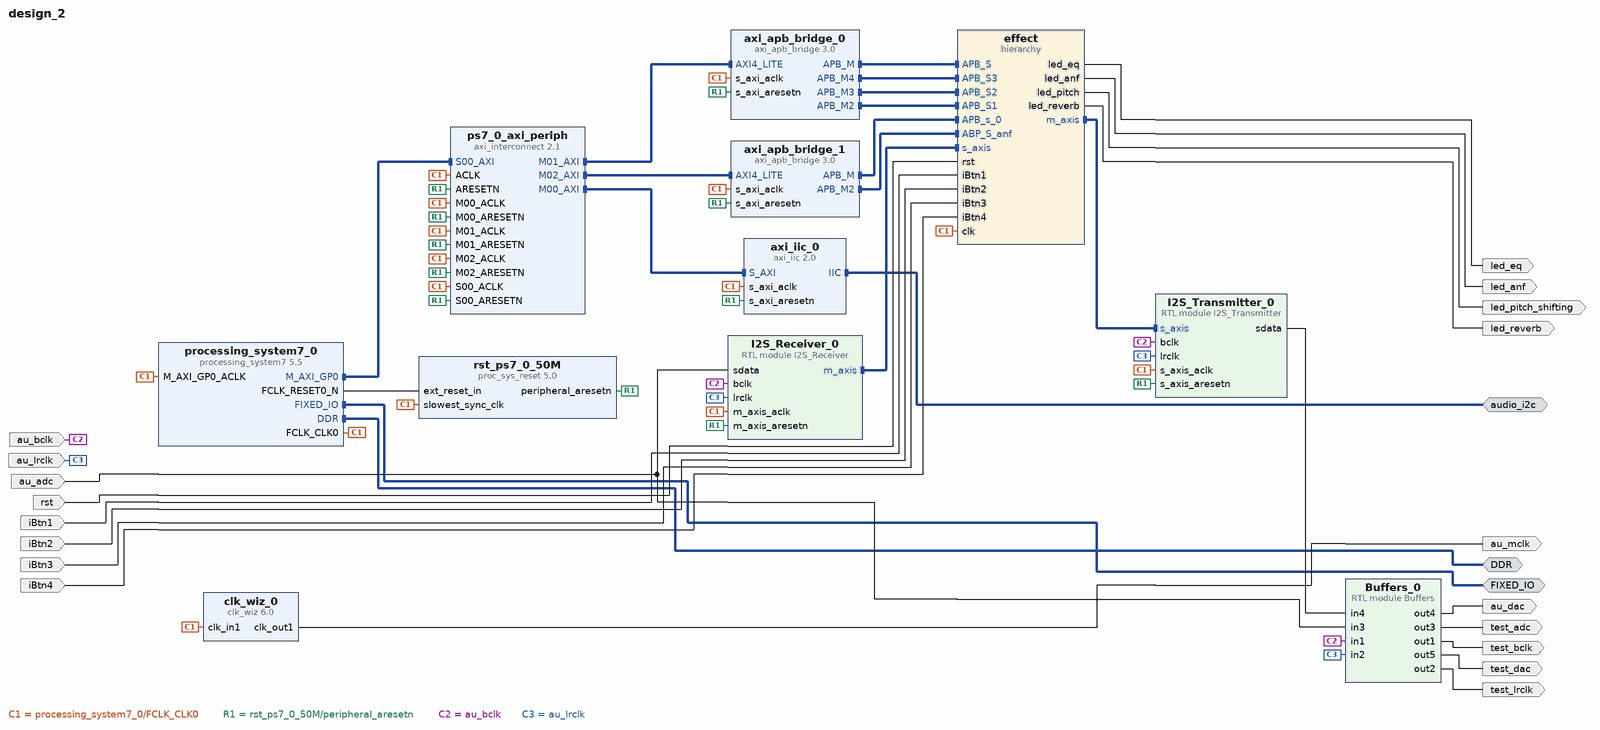
[diagram p0: block diagram of the top level]
# Vivado block design design_2, xc7z020clg400-1, Vivado 2020.1
create_bd_design design_2

create_bd_intf_port -mode Master -vlnv xilinx.com:interface:iic_rtl:1.0 audio_i2c
create_bd_intf_port -mode Master -vlnv xilinx.com:interface:ddrx_rtl:1.0 DDR
create_bd_intf_port -mode Master -vlnv xilinx.com:display_processing_system7:fixedio_rtl:1.0 FIXED_IO
create_bd_port -dir I au_bclk
create_bd_port -dir I au_lrclk
create_bd_port -dir I au_adc
create_bd_port -dir O test_bclk
create_bd_port -dir O test_lrclk
create_bd_port -dir O test_adc
create_bd_port -dir O au_dac
create_bd_port -dir O test_dac
create_bd_port -dir O led_eq
create_bd_port -dir I -type rst rst
create_bd_port -dir I iBtn1
create_bd_port -dir O led_reverb
create_bd_port -dir I iBtn2
create_bd_port -dir O led_pitch_shifting
create_bd_port -dir I iBtn3
create_bd_port -dir O led_anf
create_bd_port -dir I iBtn4
create_bd_port -dir O -type clk au_mclk
set_property -dict {CONFIG.FREQ_HZ 12286002} [get_bd_ports au_mclk]

create_bd_cell -type ip -vlnv xilinx.com:ip:processing_system7:5.5 processing_system7_0
set_property -dict [list \
  CONFIG.PCW_APU_PERIPHERAL_FREQMHZ 650 \
  CONFIG.PCW_CRYSTAL_PERIPHERAL_FREQMHZ 50 \
  CONFIG.PCW_ENET0_ENET0_IO {MIO 16 .. 27} \
  CONFIG.PCW_ENET0_GRP_MDIO_ENABLE 1 \
  CONFIG.PCW_ENET0_GRP_MDIO_IO {MIO 52 .. 53} \
  CONFIG.PCW_ENET0_PERIPHERAL_ENABLE 1 \
  CONFIG.PCW_ENET0_RESET_ENABLE 1 \
  CONFIG.PCW_ENET0_RESET_IO {MIO 9} \
  CONFIG.PCW_ENET_RESET_ENABLE 1 \
  CONFIG.PCW_ENET_RESET_SELECT {Share reset pin} \
  CONFIG.PCW_FPGA0_PERIPHERAL_FREQMHZ 50 \
  CONFIG.PCW_FPGA1_PERIPHERAL_FREQMHZ 10 \
  CONFIG.PCW_GPIO_MIO_GPIO_ENABLE 1 \
  CONFIG.PCW_GPIO_MIO_GPIO_IO MIO \
  CONFIG.PCW_I2C_RESET_ENABLE 1 \
  CONFIG.PCW_M_AXI_GP0_FREQMHZ 10 \
  CONFIG.PCW_PERIPHERAL_BOARD_PRESET part0 \
  CONFIG.PCW_PRESET_BANK1_VOLTAGE {LVCMOS 1.8V} \
  CONFIG.PCW_QSPI_GRP_FBCLK_ENABLE 1 \
  CONFIG.PCW_QSPI_GRP_FBCLK_IO {MIO 8} \
  CONFIG.PCW_QSPI_GRP_SINGLE_SS_ENABLE 1 \
  CONFIG.PCW_QSPI_GRP_SINGLE_SS_IO {MIO 1 .. 6} \
  CONFIG.PCW_QSPI_PERIPHERAL_ENABLE 1 \
  CONFIG.PCW_QSPI_QSPI_IO {MIO 1 .. 6} \
  CONFIG.PCW_SD0_GRP_CD_ENABLE 1 \
  CONFIG.PCW_SD0_GRP_CD_IO {MIO 47} \
  CONFIG.PCW_SD0_GRP_WP_ENABLE 0 \
  CONFIG.PCW_SD0_PERIPHERAL_ENABLE 1 \
  CONFIG.PCW_SD0_SD0_IO {MIO 40 .. 45} \
  CONFIG.PCW_SDIO_PERIPHERAL_FREQMHZ 50 \
  CONFIG.PCW_SINGLE_QSPI_DATA_MODE x4 \
  CONFIG.PCW_UART0_PERIPHERAL_ENABLE 1 \
  CONFIG.PCW_UART0_UART0_IO {MIO 14 .. 15} \
  CONFIG.PCW_UART1_PERIPHERAL_ENABLE 0 \
  CONFIG.PCW_UART_PERIPHERAL_FREQMHZ 100 \
  CONFIG.PCW_UIPARAM_DDR_BUS_WIDTH {16 Bit} \
  CONFIG.PCW_UIPARAM_DDR_FREQ_MHZ 525 \
  CONFIG.PCW_UIPARAM_DDR_PARTNO {MT41J256M16 RE-125} \
  CONFIG.PCW_USB0_PERIPHERAL_ENABLE 1 \
  CONFIG.PCW_USB0_RESET_ENABLE 1 \
  CONFIG.PCW_USB0_RESET_IO {MIO 46} \
  CONFIG.PCW_USB0_USB0_IO {MIO 28 .. 39} \
  CONFIG.PCW_USB_RESET_ENABLE 1 \
  CONFIG.PCW_USB_RESET_SELECT {Share reset pin} \
] [get_bd_cells processing_system7_0]
# 486 more settings of processing_system7_0 are not shown: defaults, MIO pin electricals, DDR timing, and values the tool derives
create_bd_cell -type ip -vlnv xilinx.com:ip:axi_iic:2.0 axi_iic_0
set_property -dict {CONFIG.IIC_BOARD_INTERFACE audio_i2c CONFIG.USE_BOARD_FLOW true} [get_bd_cells axi_iic_0]
create_bd_cell -type ip -vlnv xilinx.com:ip:axi_interconnect:2.1 ps7_0_axi_periph
set_property -dict {CONFIG.NUM_MI 3 CONFIG.NUM_SI 1} [get_bd_cells ps7_0_axi_periph]
create_bd_cell -type ip -vlnv xilinx.com:ip:proc_sys_reset:5.0 rst_ps7_0_50M
create_bd_cell -type ip -vlnv xilinx.com:ip:axi_apb_bridge:3.0 axi_apb_bridge_0
set_property -dict {CONFIG.C_APB_NUM_SLAVES 4} [get_bd_cells axi_apb_bridge_0]
create_bd_cell -type hier effect
create_bd_cell -type ip -vlnv xilinx.com:ip:axi_apb_bridge:3.0 axi_apb_bridge_1
set_property -dict {CONFIG.C_APB_NUM_SLAVES 2} [get_bd_cells axi_apb_bridge_1]
create_bd_cell -type module -reference I2S_Receiver I2S_Receiver_0
set_property -dict {CONFIG.DATA_WIDTH 24} [get_bd_cells I2S_Receiver_0]
create_bd_cell -type module -reference I2S_Transmitter I2S_Transmitter_0
set_property -dict {CONFIG.DATA_WIDTH 24} [get_bd_cells I2S_Transmitter_0]
create_bd_cell -type module -reference Buffers Buffers_0
create_bd_cell -type ip -vlnv xilinx.com:ip:clk_wiz:6.0 clk_wiz_0
set_property -dict [list \
  CONFIG.CLKOUT1_JITTER 373.299 \
  CONFIG.CLKOUT1_PHASE_ERROR 409.976 \
  CONFIG.CLKOUT1_REQUESTED_OUT_FREQ 12.286 \
  CONFIG.MMCM_CLKFBOUT_MULT_F 61.000 \
  CONFIG.MMCM_CLKOUT0_DIVIDE_F 82.750 \
  CONFIG.MMCM_DIVCLK_DIVIDE 3 \
  CONFIG.USE_LOCKED false \
  CONFIG.USE_RESET false \
] [get_bd_cells clk_wiz_0]

# ---- hierarchy /effect ----
current_bd_instance /effect
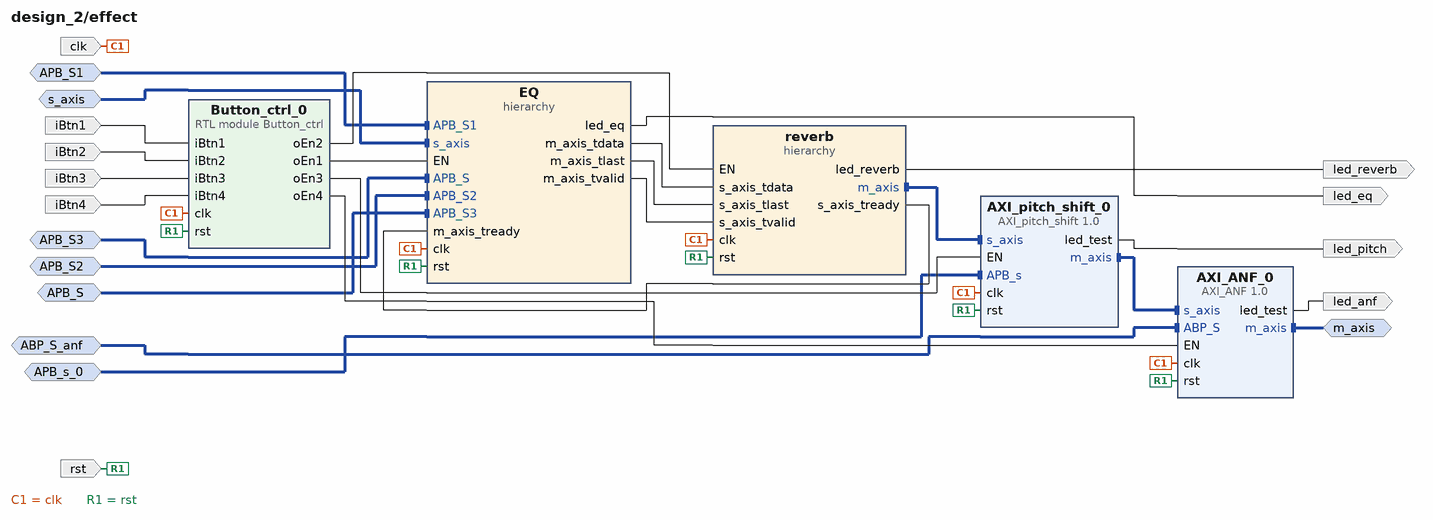
[diagram p1: block diagram inside /effect]
create_bd_intf_pin -mode Slave -vlnv xilinx.com:interface:axis_rtl:1.0 s_axis
create_bd_intf_pin -mode Slave -vlnv xilinx.com:interface:apb_rtl:1.0 APB_S
create_bd_intf_pin -mode Slave -vlnv xilinx.com:interface:apb_rtl:1.0 APB_S1
create_bd_intf_pin -mode Slave -vlnv xilinx.com:interface:apb_rtl:1.0 APB_S2
create_bd_intf_pin -mode Master -vlnv xilinx.com:interface:axis_rtl:1.0 m_axis
create_bd_intf_pin -mode Slave -vlnv xilinx.com:interface:apb_rtl:1.0 APB_S3
create_bd_intf_pin -mode Slave -vlnv xilinx.com:interface:apb_rtl:1.0 APB_s_0
create_bd_intf_pin -mode Slave -vlnv xilinx.com:interface:apb_rtl:1.0 ABP_S_anf
create_bd_pin -dir I -type clk clk
create_bd_pin -dir I -type rst rst
create_bd_pin -dir I iBtn1
create_bd_pin -dir O led_eq
create_bd_pin -dir O led_reverb
create_bd_pin -dir I iBtn2
create_bd_pin -dir O led_pitch
create_bd_pin -dir I iBtn3
create_bd_pin -dir O led_anf
create_bd_pin -dir I iBtn4

create_bd_cell -type hier reverb
create_bd_cell -type ip -vlnv xilinx.com:user:AXI_pitch_shift:1.0 AXI_pitch_shift_0
create_bd_cell -type hier EQ
create_bd_cell -type ip -vlnv xilinx.com:user:AXI_ANF:1.0 AXI_ANF_0
create_bd_cell -type module -reference Button_ctrl Button_ctrl_0

# ---- hierarchy /effect/reverb ----
current_bd_instance /effect/reverb
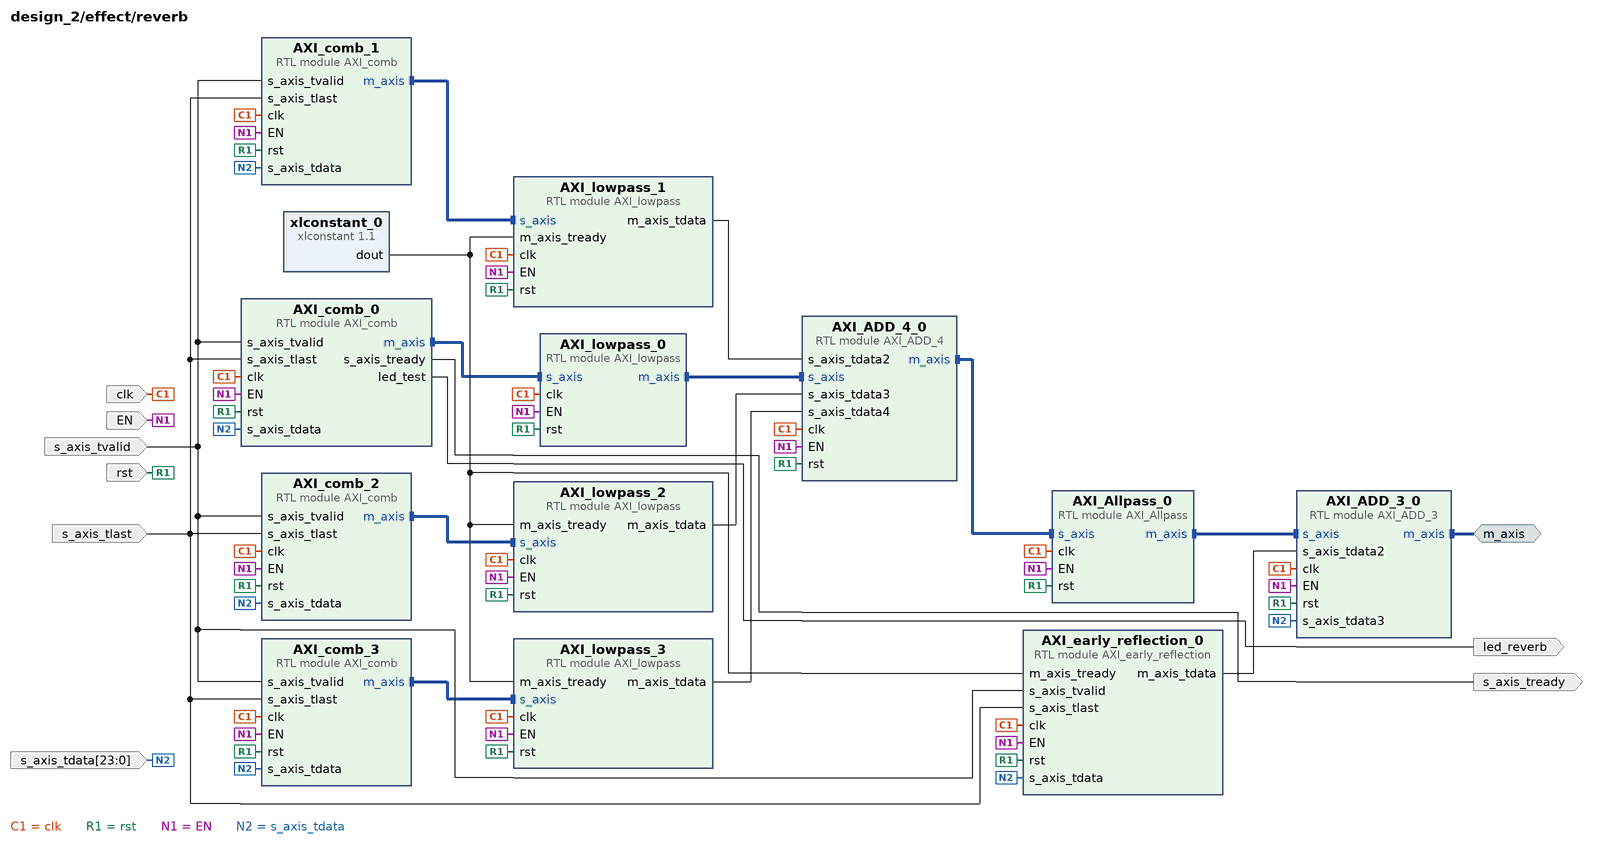
[diagram p2: block diagram inside /effect/reverb]
create_bd_intf_pin -mode Master -vlnv xilinx.com:interface:axis_rtl:1.0 m_axis
create_bd_pin -dir I -type clk clk
create_bd_pin -dir I -type rst rst
create_bd_pin -dir I EN
create_bd_pin -dir I -from 23 -to 0 s_axis_tdata
create_bd_pin -dir I s_axis_tvalid
create_bd_pin -dir I s_axis_tlast
create_bd_pin -dir O s_axis_tready
create_bd_pin -dir O led_reverb

create_bd_cell -type module -reference AXI_comb AXI_comb_1
set_property -dict {CONFIG.Delay 2053} [get_bd_cells AXI_comb_1]
create_bd_cell -type module -reference AXI_comb AXI_comb_2
set_property -dict {CONFIG.Delay 1687} [get_bd_cells AXI_comb_2]
create_bd_cell -type module -reference AXI_comb AXI_comb_3
set_property -dict {CONFIG.Delay 2251} [get_bd_cells AXI_comb_3]
create_bd_cell -type module -reference AXI_lowpass AXI_lowpass_1
create_bd_cell -type module -reference AXI_lowpass AXI_lowpass_2
create_bd_cell -type ip -vlnv xilinx.com:ip:xlconstant:1.1 xlconstant_0
create_bd_cell -type module -reference AXI_lowpass AXI_lowpass_3
create_bd_cell -type module -reference AXI_comb AXI_comb_0
set_property -dict {CONFIG.Delay 347} [get_bd_cells AXI_comb_0]
create_bd_cell -type module -reference AXI_lowpass AXI_lowpass_0
create_bd_cell -type module -reference AXI_early_reflection AXI_early_reflection_0
create_bd_cell -type module -reference AXI_Allpass AXI_Allpass_0
set_property -dict {CONFIG.Delay 347} [get_bd_cells AXI_Allpass_0]
create_bd_cell -type module -reference AXI_ADD_4 AXI_ADD_4_0
create_bd_cell -type module -reference AXI_ADD_3 AXI_ADD_3_0

# ---- hierarchy /effect/EQ ----
current_bd_instance /effect/EQ
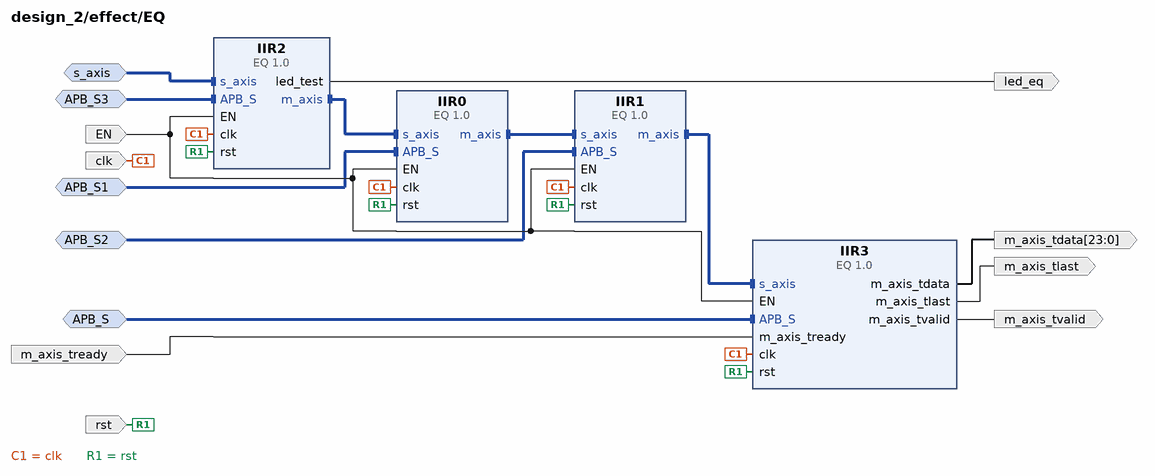
[diagram p3: block diagram inside /effect/EQ]
create_bd_intf_pin -mode Slave -vlnv xilinx.com:interface:apb_rtl:1.0 APB_S
create_bd_intf_pin -mode Slave -vlnv xilinx.com:interface:apb_rtl:1.0 APB_S1
create_bd_intf_pin -mode Slave -vlnv xilinx.com:interface:apb_rtl:1.0 APB_S2
create_bd_intf_pin -mode Slave -vlnv xilinx.com:interface:axis_rtl:1.0 s_axis
create_bd_intf_pin -mode Slave -vlnv xilinx.com:interface:apb_rtl:1.0 APB_S3
create_bd_pin -dir I -type clk clk
create_bd_pin -dir I -type rst rst
create_bd_pin -dir I EN
create_bd_pin -dir O -from 23 -to 0 m_axis_tdata
create_bd_pin -dir O m_axis_tvalid
create_bd_pin -dir O m_axis_tlast
create_bd_pin -dir I m_axis_tready
create_bd_pin -dir O led_eq

create_bd_cell -type ip -vlnv xilinx.com:user:EQ:1.0 IIR3
create_bd_cell -type ip -vlnv xilinx.com:user:EQ:1.0 IIR0
create_bd_cell -type ip -vlnv xilinx.com:user:EQ:1.0 IIR1
create_bd_cell -type ip -vlnv xilinx.com:user:EQ:1.0 IIR2

# ---- connections ----

current_bd_instance /effect
connect_bd_intf_net [get_bd_intf_pins AXI_ANF_0/s_axis] [get_bd_intf_pins AXI_pitch_shift_0/m_axis]
connect_bd_intf_net -intf_net axi_apb_bridge_0_APB_M2 [get_bd_intf_pins APB_S1] [get_bd_intf_pins EQ/APB_S1]
connect_bd_intf_net -intf_net I2S_Receiver_0_m_axis [get_bd_intf_pins s_axis] [get_bd_intf_pins EQ/s_axis]
connect_bd_intf_net -intf_net axi_apb_bridge_0_APB_M4 [get_bd_intf_pins APB_S3] [get_bd_intf_pins EQ/APB_S]
connect_bd_intf_net [get_bd_intf_pins m_axis] [get_bd_intf_pins AXI_ANF_0/m_axis]
connect_bd_intf_net [get_bd_intf_pins ABP_S_anf] [get_bd_intf_pins AXI_ANF_0/ABP_S]
connect_bd_intf_net -intf_net axi_apb_bridge_0_APB_M3 [get_bd_intf_pins APB_S2] [get_bd_intf_pins EQ/APB_S2]
connect_bd_intf_net -intf_net axi_apb_bridge_0_APB_M [get_bd_intf_pins APB_S] [get_bd_intf_pins EQ/APB_S3]
connect_bd_intf_net [get_bd_intf_pins AXI_pitch_shift_0/s_axis] [get_bd_intf_pins reverb/m_axis]
connect_bd_intf_net -intf_net APB_s_0_1 [get_bd_intf_pins APB_s_0] [get_bd_intf_pins AXI_pitch_shift_0/APB_s]
connect_bd_net [get_bd_pins Button_ctrl_0/oEn1] [get_bd_pins EQ/EN]
connect_bd_net -net processing_system7_0_FCLK_CLK0 [get_bd_pins clk] \
  [get_bd_pins reverb/clk] [get_bd_pins AXI_pitch_shift_0/clk] [get_bd_pins EQ/clk] [get_bd_pins AXI_ANF_0/clk] \
  [get_bd_pins Button_ctrl_0/clk]
connect_bd_net [get_bd_pins rst] \
  [get_bd_pins reverb/rst] [get_bd_pins AXI_pitch_shift_0/rst] [get_bd_pins EQ/rst] [get_bd_pins AXI_ANF_0/rst] \
  [get_bd_pins Button_ctrl_0/rst]
connect_bd_net -net iBtn1_1 [get_bd_pins iBtn1] [get_bd_pins Button_ctrl_0/iBtn1]
connect_bd_net -net EQ_0_led_test [get_bd_pins EQ/led_eq] [get_bd_pins led_eq]
connect_bd_net [get_bd_pins Button_ctrl_0/oEn2] [get_bd_pins reverb/EN]
connect_bd_net -net AXI_comb_0_led_test [get_bd_pins reverb/led_reverb] [get_bd_pins led_reverb]
connect_bd_net -net iBtn2_0_1 [get_bd_pins iBtn2] [get_bd_pins Button_ctrl_0/iBtn2]
connect_bd_net -net EQ_3_m_axis_tdata [get_bd_pins EQ/m_axis_tdata] [get_bd_pins reverb/s_axis_tdata]
connect_bd_net -net EQ_3_m_axis_tlast [get_bd_pins EQ/m_axis_tlast] [get_bd_pins reverb/s_axis_tlast]
connect_bd_net -net EQ_3_m_axis_tvalid [get_bd_pins EQ/m_axis_tvalid] [get_bd_pins reverb/s_axis_tvalid]
connect_bd_net -net AXI_comb_0_s_axis_tready [get_bd_pins reverb/s_axis_tready] [get_bd_pins EQ/m_axis_tready]
connect_bd_net -net iBtn3_0_1 [get_bd_pins iBtn3] [get_bd_pins Button_ctrl_0/iBtn3]
connect_bd_net -net iBtn4_0_1 [get_bd_pins iBtn4] [get_bd_pins Button_ctrl_0/iBtn4]
connect_bd_net [get_bd_pins AXI_pitch_shift_0/led_test] [get_bd_pins led_pitch]
connect_bd_net [get_bd_pins Button_ctrl_0/oEn3] [get_bd_pins AXI_pitch_shift_0/EN]
connect_bd_net [get_bd_pins AXI_ANF_0/led_test] [get_bd_pins led_anf]
connect_bd_net [get_bd_pins Button_ctrl_0/oEn4] [get_bd_pins AXI_ANF_0/EN]

current_bd_instance /effect/reverb
connect_bd_intf_net [get_bd_intf_pins AXI_comb_1/m_axis] [get_bd_intf_pins AXI_lowpass_1/s_axis]
connect_bd_intf_net [get_bd_intf_pins AXI_lowpass_0/m_axis] [get_bd_intf_pins AXI_ADD_4_0/s_axis]
connect_bd_intf_net [get_bd_intf_pins m_axis] [get_bd_intf_pins AXI_ADD_3_0/m_axis]
connect_bd_intf_net [get_bd_intf_pins AXI_comb_3/m_axis] [get_bd_intf_pins AXI_lowpass_3/s_axis]
connect_bd_intf_net [get_bd_intf_pins AXI_ADD_3_0/s_axis] [get_bd_intf_pins AXI_Allpass_0/m_axis]
connect_bd_intf_net [get_bd_intf_pins AXI_ADD_4_0/m_axis] [get_bd_intf_pins AXI_Allpass_0/s_axis]
connect_bd_intf_net [get_bd_intf_pins AXI_comb_2/m_axis] [get_bd_intf_pins AXI_lowpass_2/s_axis]
connect_bd_intf_net [get_bd_intf_pins AXI_comb_0/m_axis] [get_bd_intf_pins AXI_lowpass_0/s_axis]
connect_bd_net [get_bd_pins AXI_lowpass_1/m_axis_tdata] [get_bd_pins AXI_ADD_4_0/s_axis_tdata2]
connect_bd_net [get_bd_pins xlconstant_0/dout] \
  [get_bd_pins AXI_lowpass_2/m_axis_tready] [get_bd_pins AXI_lowpass_3/m_axis_tready] \
  [get_bd_pins AXI_lowpass_1/m_axis_tready] [get_bd_pins AXI_early_reflection_0/m_axis_tready]
connect_bd_net [get_bd_pins AXI_lowpass_2/m_axis_tdata] [get_bd_pins AXI_ADD_4_0/s_axis_tdata3]
connect_bd_net [get_bd_pins AXI_lowpass_3/m_axis_tdata] [get_bd_pins AXI_ADD_4_0/s_axis_tdata4]
connect_bd_net -net processing_system7_0_FCLK_CLK0 [get_bd_pins clk] \
  [get_bd_pins AXI_comb_1/clk] [get_bd_pins AXI_comb_2/clk] [get_bd_pins AXI_comb_3/clk] [get_bd_pins AXI_lowpass_1/clk] \
  [get_bd_pins AXI_lowpass_2/clk] [get_bd_pins AXI_lowpass_3/clk] [get_bd_pins AXI_comb_0/clk] \
  [get_bd_pins AXI_lowpass_0/clk] [get_bd_pins AXI_early_reflection_0/clk] [get_bd_pins AXI_Allpass_0/clk] \
  [get_bd_pins AXI_ADD_4_0/clk] [get_bd_pins AXI_ADD_3_0/clk]
connect_bd_net [get_bd_pins rst] \
  [get_bd_pins AXI_comb_1/rst] [get_bd_pins AXI_comb_2/rst] [get_bd_pins AXI_comb_3/rst] [get_bd_pins AXI_lowpass_1/rst] \
  [get_bd_pins AXI_lowpass_2/rst] [get_bd_pins AXI_lowpass_3/rst] [get_bd_pins AXI_comb_0/rst] \
  [get_bd_pins AXI_lowpass_0/rst] [get_bd_pins AXI_early_reflection_0/rst] [get_bd_pins AXI_Allpass_0/rst] \
  [get_bd_pins AXI_ADD_4_0/rst] [get_bd_pins AXI_ADD_3_0/rst]
connect_bd_net -net Button_ctrl_0_oEn2 [get_bd_pins EN] \
  [get_bd_pins AXI_comb_1/EN] [get_bd_pins AXI_comb_2/EN] [get_bd_pins AXI_comb_3/EN] [get_bd_pins AXI_lowpass_1/EN] \
  [get_bd_pins AXI_lowpass_2/EN] [get_bd_pins AXI_lowpass_3/EN] [get_bd_pins AXI_comb_0/EN] [get_bd_pins AXI_lowpass_0/EN] \
  [get_bd_pins AXI_early_reflection_0/EN] [get_bd_pins AXI_Allpass_0/EN] [get_bd_pins AXI_ADD_4_0/EN] \
  [get_bd_pins AXI_ADD_3_0/EN]
connect_bd_net -net EQ_3_m_axis_tdata [get_bd_pins s_axis_tdata] \
  [get_bd_pins AXI_comb_1/s_axis_tdata] [get_bd_pins AXI_comb_2/s_axis_tdata] [get_bd_pins AXI_comb_3/s_axis_tdata] \
  [get_bd_pins AXI_comb_0/s_axis_tdata] [get_bd_pins AXI_early_reflection_0/s_axis_tdata] \
  [get_bd_pins AXI_ADD_3_0/s_axis_tdata3]
connect_bd_net -net EQ_3_m_axis_tvalid [get_bd_pins s_axis_tvalid] \
  [get_bd_pins AXI_comb_1/s_axis_tvalid] [get_bd_pins AXI_comb_2/s_axis_tvalid] [get_bd_pins AXI_comb_3/s_axis_tvalid] \
  [get_bd_pins AXI_comb_0/s_axis_tvalid] [get_bd_pins AXI_early_reflection_0/s_axis_tvalid]
connect_bd_net -net EQ_3_m_axis_tlast [get_bd_pins s_axis_tlast] \
  [get_bd_pins AXI_comb_1/s_axis_tlast] [get_bd_pins AXI_comb_2/s_axis_tlast] [get_bd_pins AXI_comb_3/s_axis_tlast] \
  [get_bd_pins AXI_comb_0/s_axis_tlast] [get_bd_pins AXI_early_reflection_0/s_axis_tlast]
connect_bd_net [get_bd_pins AXI_comb_0/s_axis_tready] [get_bd_pins s_axis_tready]
connect_bd_net [get_bd_pins AXI_comb_0/led_test] [get_bd_pins led_reverb]
connect_bd_net [get_bd_pins AXI_early_reflection_0/m_axis_tdata] [get_bd_pins AXI_ADD_3_0/s_axis_tdata2]

current_bd_instance /effect/EQ
connect_bd_intf_net -intf_net I2S_Receiver_0_m_axis [get_bd_intf_pins s_axis] [get_bd_intf_pins IIR2/s_axis]
connect_bd_intf_net -intf_net EQ_1_m_axis [get_bd_intf_pins IIR0/m_axis] [get_bd_intf_pins IIR1/s_axis]
connect_bd_intf_net -intf_net axi_apb_bridge_0_APB_M2 [get_bd_intf_pins APB_S1] [get_bd_intf_pins IIR0/APB_S]
connect_bd_intf_net -intf_net EQ_0_m_axis [get_bd_intf_pins IIR2/m_axis] [get_bd_intf_pins IIR0/s_axis]
connect_bd_intf_net -intf_net EQ_2_m_axis [get_bd_intf_pins IIR1/m_axis] [get_bd_intf_pins IIR3/s_axis]
connect_bd_intf_net -intf_net axi_apb_bridge_0_APB_M3 [get_bd_intf_pins APB_S2] [get_bd_intf_pins IIR1/APB_S]
connect_bd_intf_net -intf_net axi_apb_bridge_0_APB_M4 [get_bd_intf_pins APB_S] [get_bd_intf_pins IIR3/APB_S]
connect_bd_intf_net -intf_net axi_apb_bridge_0_APB_M [get_bd_intf_pins APB_S3] [get_bd_intf_pins IIR2/APB_S]
connect_bd_net -net processing_system7_0_FCLK_CLK0 [get_bd_pins clk] \
  [get_bd_pins IIR2/clk] [get_bd_pins IIR0/clk] [get_bd_pins IIR1/clk] [get_bd_pins IIR3/clk]
connect_bd_net [get_bd_pins rst] [get_bd_pins IIR1/rst] [get_bd_pins IIR0/rst] [get_bd_pins IIR2/rst] [get_bd_pins IIR3/rst]
connect_bd_net [get_bd_pins EN] [get_bd_pins IIR2/EN] [get_bd_pins IIR0/EN] [get_bd_pins IIR1/EN] [get_bd_pins IIR3/EN]
connect_bd_net -net EQ_3_m_axis_tdata [get_bd_pins IIR3/m_axis_tdata] [get_bd_pins m_axis_tdata]
connect_bd_net -net EQ_3_m_axis_tvalid [get_bd_pins IIR3/m_axis_tvalid] [get_bd_pins m_axis_tvalid]
connect_bd_net -net EQ_3_m_axis_tlast [get_bd_pins IIR3/m_axis_tlast] [get_bd_pins m_axis_tlast]
connect_bd_net -net AXI_comb_0_s_axis_tready [get_bd_pins m_axis_tready] [get_bd_pins IIR3/m_axis_tready]
connect_bd_net -net EQ_0_led_test [get_bd_pins IIR2/led_test] [get_bd_pins led_eq]

current_bd_instance /
connect_bd_intf_net [get_bd_intf_pins ps7_0_axi_periph/M01_AXI] [get_bd_intf_pins axi_apb_bridge_0/AXI4_LITE]
connect_bd_intf_net [get_bd_intf_pins processing_system7_0/M_AXI_GP0] [get_bd_intf_pins ps7_0_axi_periph/S00_AXI]
connect_bd_intf_net [get_bd_intf_ports FIXED_IO] [get_bd_intf_pins processing_system7_0/FIXED_IO]
connect_bd_intf_net [get_bd_intf_pins ps7_0_axi_periph/M02_AXI] [get_bd_intf_pins axi_apb_bridge_1/AXI4_LITE]
connect_bd_intf_net [get_bd_intf_ports DDR] [get_bd_intf_pins processing_system7_0/DDR]
connect_bd_intf_net -intf_net EQ_3_m_axis [get_bd_intf_pins I2S_Transmitter_0/s_axis] [get_bd_intf_pins effect/m_axis]
connect_bd_intf_net [get_bd_intf_pins axi_apb_bridge_0/APB_M] [get_bd_intf_pins effect/APB_S]
connect_bd_intf_net -intf_net APB_s_0_1 [get_bd_intf_pins effect/APB_s_0] [get_bd_intf_pins axi_apb_bridge_1/APB_M]
connect_bd_intf_net [get_bd_intf_pins axi_apb_bridge_0/APB_M4] [get_bd_intf_pins effect/APB_S3]
connect_bd_intf_net [get_bd_intf_pins axi_apb_bridge_0/APB_M3] [get_bd_intf_pins effect/APB_S2]
connect_bd_intf_net [get_bd_intf_ports audio_i2c] [get_bd_intf_pins axi_iic_0/IIC]
connect_bd_intf_net [get_bd_intf_pins axi_apb_bridge_1/APB_M2] [get_bd_intf_pins effect/ABP_S_anf]
connect_bd_intf_net [get_bd_intf_pins I2S_Receiver_0/m_axis] [get_bd_intf_pins effect/s_axis]
connect_bd_intf_net [get_bd_intf_pins ps7_0_axi_periph/M00_AXI] [get_bd_intf_pins axi_iic_0/S_AXI]
connect_bd_intf_net [get_bd_intf_pins axi_apb_bridge_0/APB_M2] [get_bd_intf_pins effect/APB_S1]
connect_bd_net [get_bd_pins processing_system7_0/FCLK_CLK0] \
  [get_bd_pins processing_system7_0/M_AXI_GP0_ACLK] [get_bd_pins ps7_0_axi_periph/S00_ACLK] \
  [get_bd_pins rst_ps7_0_50M/slowest_sync_clk] [get_bd_pins axi_iic_0/s_axi_aclk] [get_bd_pins ps7_0_axi_periph/M00_ACLK] \
  [get_bd_pins ps7_0_axi_periph/ACLK] [get_bd_pins ps7_0_axi_periph/M01_ACLK] [get_bd_pins axi_apb_bridge_0/s_axi_aclk] \
  [get_bd_pins effect/clk] [get_bd_pins axi_apb_bridge_1/s_axi_aclk] [get_bd_pins ps7_0_axi_periph/M02_ACLK] \
  [get_bd_pins I2S_Receiver_0/m_axis_aclk] [get_bd_pins I2S_Transmitter_0/s_axis_aclk] [get_bd_pins clk_wiz_0/clk_in1]
connect_bd_net [get_bd_pins processing_system7_0/FCLK_RESET0_N] [get_bd_pins rst_ps7_0_50M/ext_reset_in]
connect_bd_net [get_bd_pins rst_ps7_0_50M/peripheral_aresetn] \
  [get_bd_pins ps7_0_axi_periph/S00_ARESETN] [get_bd_pins axi_iic_0/s_axi_aresetn] [get_bd_pins ps7_0_axi_periph/M00_ARESETN] \
  [get_bd_pins ps7_0_axi_periph/ARESETN] [get_bd_pins ps7_0_axi_periph/M01_ARESETN] \
  [get_bd_pins axi_apb_bridge_0/s_axi_aresetn] [get_bd_pins axi_apb_bridge_1/s_axi_aresetn] \
  [get_bd_pins ps7_0_axi_periph/M02_ARESETN] [get_bd_pins I2S_Receiver_0/m_axis_aresetn] \
  [get_bd_pins I2S_Transmitter_0/s_axis_aresetn]
connect_bd_net -net bclk_0_1 [get_bd_ports au_bclk] [get_bd_pins I2S_Receiver_0/bclk] [get_bd_pins I2S_Transmitter_0/bclk] [get_bd_pins Buffers_0/in1]
connect_bd_net -net lrclk_0_1 [get_bd_ports au_lrclk] \
  [get_bd_pins I2S_Receiver_0/lrclk] [get_bd_pins I2S_Transmitter_0/lrclk] [get_bd_pins Buffers_0/in2]
connect_bd_net -net sdata_0_1 [get_bd_ports au_adc] [get_bd_pins I2S_Receiver_0/sdata] [get_bd_pins Buffers_0/in3]
connect_bd_net [get_bd_pins I2S_Transmitter_0/sdata] [get_bd_pins Buffers_0/in4]
connect_bd_net [get_bd_pins Buffers_0/out1] [get_bd_ports test_bclk]
connect_bd_net [get_bd_pins Buffers_0/out2] [get_bd_ports test_lrclk]
connect_bd_net [get_bd_pins Buffers_0/out3] [get_bd_ports test_adc]
connect_bd_net [get_bd_pins Buffers_0/out4] [get_bd_ports au_dac]
connect_bd_net [get_bd_pins Buffers_0/out5] [get_bd_ports test_dac]
connect_bd_net [get_bd_ports rst] [get_bd_pins effect/rst]
connect_bd_net -net iBtn1_1 [get_bd_ports iBtn1] [get_bd_pins effect/iBtn1]
connect_bd_net -net EQ_0_led_test [get_bd_pins effect/led_eq] [get_bd_ports led_eq]
connect_bd_net -net effect_led_test_0 [get_bd_pins effect/led_reverb] [get_bd_ports led_reverb]
connect_bd_net -net iBtn2_0_1 [get_bd_ports iBtn2] [get_bd_pins effect/iBtn2]
connect_bd_net -net effect_led_test_1 [get_bd_pins effect/led_pitch] [get_bd_ports led_pitch_shifting]
connect_bd_net -net iBtn3_0_1 [get_bd_ports iBtn3] [get_bd_pins effect/iBtn3]
connect_bd_net -net effect_led_test_2 [get_bd_pins effect/led_anf] [get_bd_ports led_anf]
connect_bd_net -net iBtn4_0_1 [get_bd_ports iBtn4] [get_bd_pins effect/iBtn4]
connect_bd_net [get_bd_pins clk_wiz_0/clk_out1] [get_bd_ports au_mclk]

# ---- address map ----
assign_bd_address -offset 0x41600000 -range 64K -target_address_space [get_bd_addr_spaces processing_system7_0/Data] [get_bd_addr_segs axi_iic_0/S_AXI/Reg]
assign_bd_address -offset 0x43C00000 -range 64K -target_address_space [get_bd_addr_spaces processing_system7_0/Data] [get_bd_addr_segs effect/EQ/IIR2/APB_S/apb]
assign_bd_address -offset 0x43C10000 -range 64K -target_address_space [get_bd_addr_spaces processing_system7_0/Data] [get_bd_addr_segs effect/EQ/IIR0/APB_S/apb]
assign_bd_address -offset 0x43C20000 -range 64K -target_address_space [get_bd_addr_spaces processing_system7_0/Data] [get_bd_addr_segs effect/EQ/IIR1/APB_S/apb]
assign_bd_address -offset 0x43C30000 -range 64K -target_address_space [get_bd_addr_spaces processing_system7_0/Data] [get_bd_addr_segs effect/EQ/IIR3/APB_S/apb]
assign_bd_address -offset 0x43C40000 -range 64K -target_address_space [get_bd_addr_spaces processing_system7_0/Data] [get_bd_addr_segs effect/AXI_pitch_shift_0/APB_s/apb]
assign_bd_address -offset 0x43C50000 -range 64K -target_address_space [get_bd_addr_spaces processing_system7_0/Data] [get_bd_addr_segs effect/AXI_ANF_0/ABP_S/apb]

validate_bd_design
save_bd_design
